# EAGLE design MBC3_multi_1-3 (EAGLE 9.6.2)
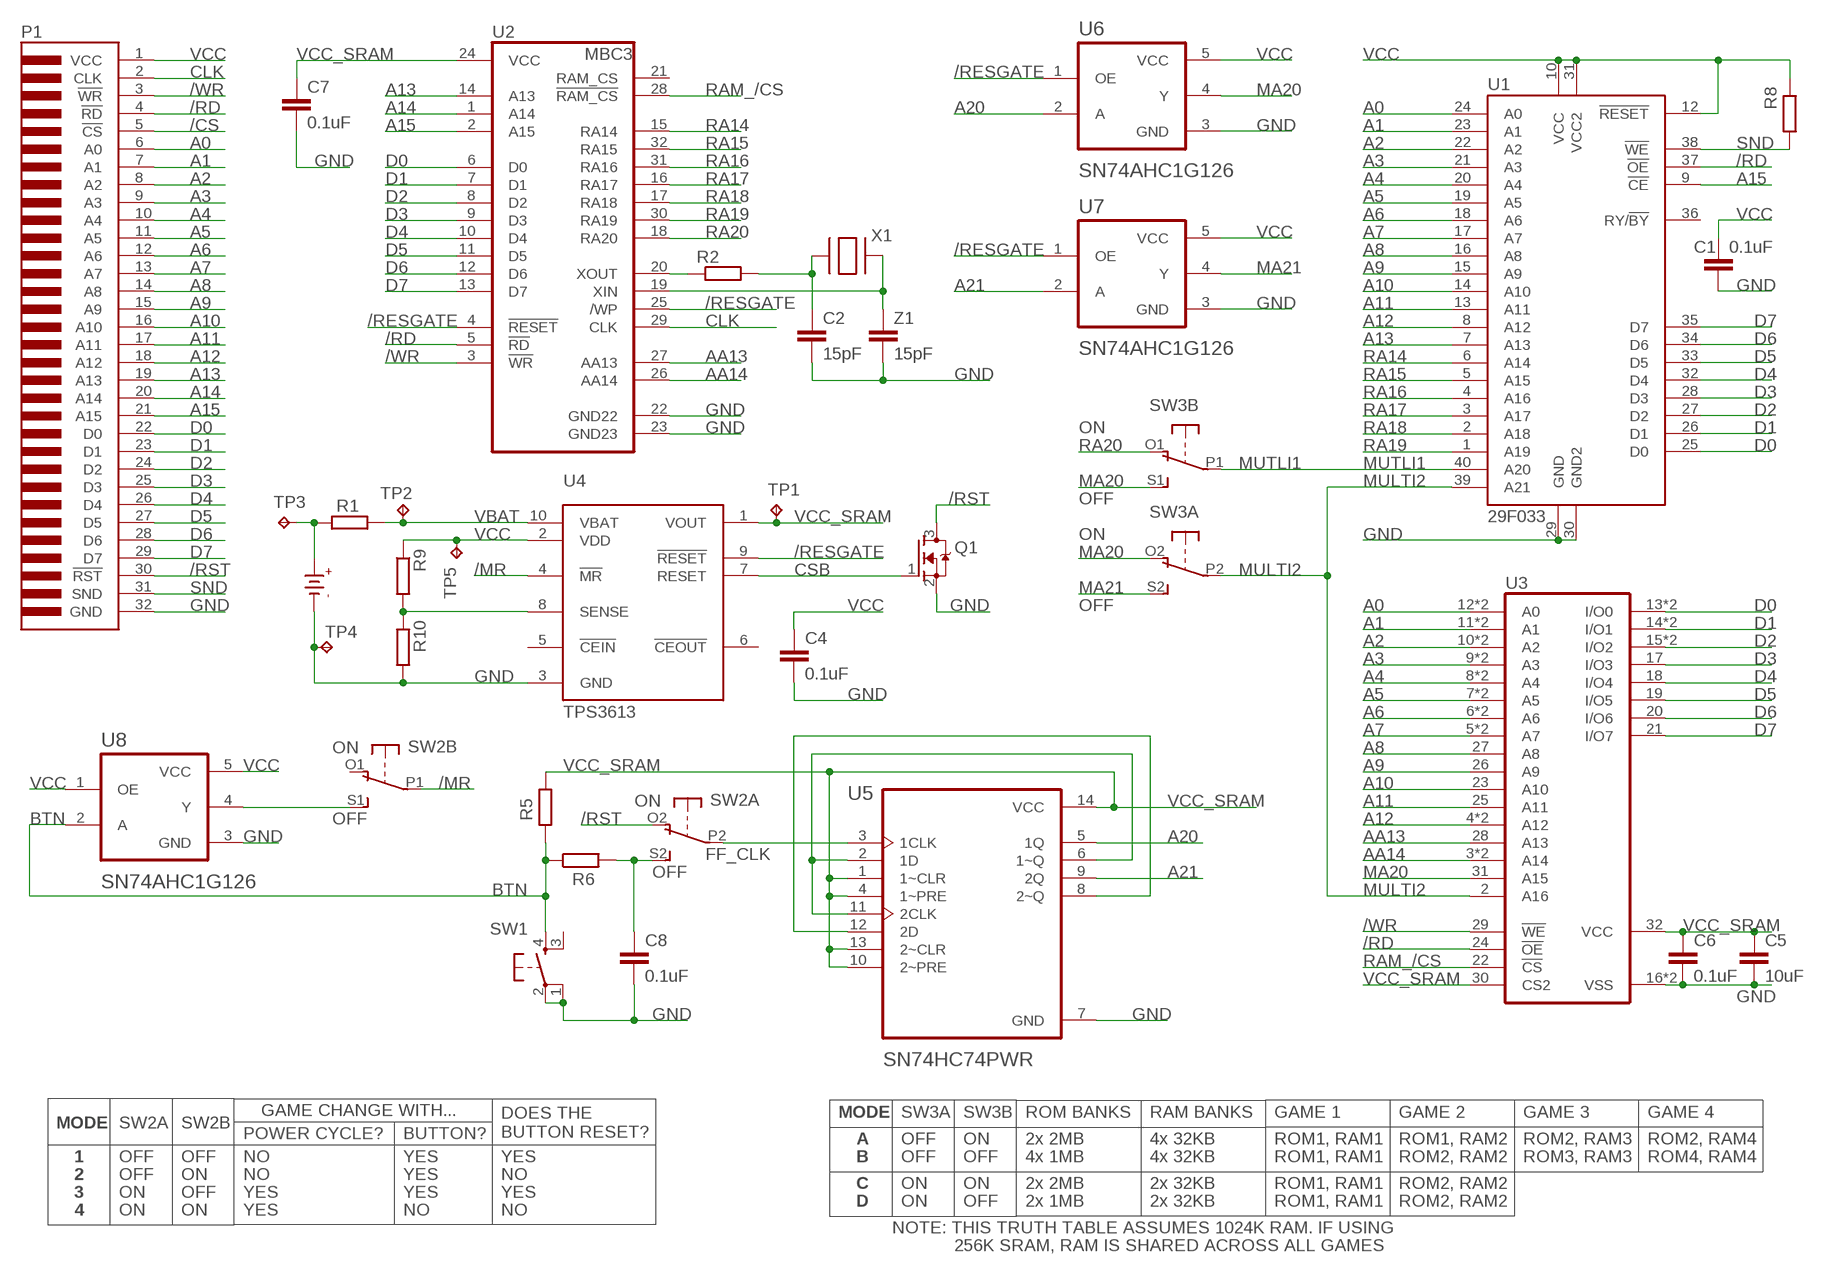
[diagram p0: schematic, sheet 1]

## Parts
C1  0.1uF  C-EUC0603  [C0603]
C2  15pF  C-EUC0603  [C0603]
C4  0.1uF  C-EUC0603  [C0603]
C5  10uF  C-EUC0603  [C0603]
C6  0.1uF  C-EUC0603  [C0603]
C7  0.1uF  C-EUC0603  [C0603]
C8  0.1uF  C-EUC0603  [C0603]
P1  GBC_CARTTAB  [GBC_CART_TABBED]
Q1  2N7002  MOSFET-NREFLOW  [SOT23]
R1  RR0603  [R0603]
R2  RR0603  [R0603]
R5  RR0603  [R0603]
R6  RR0603  [R0603]
R8  RR0603  [R0603]
R9  RR0603  [R0603]
R10  RR0603  [R0603]
SW1  SPST_TACT-KMR2  [KMR2]
SW2  SPDT-2S  [CAS-D20A]
SW3  SPDT-2S  [CAS-D20A]
TP1  TPB1,27  [B1,27]
TP2  TPB1,27  [B1,27]
TP3  TPB1,27  [B1,27]
TP4  TPB1,27  [B1,27]
TP5  TPB1,27  [B1,27]
U1  29F033  [TSOP-40]
U2  MBC3  [QFP-32]
U3  1008_62256_SRAM  [SOP-32L]
U4  TPS3613  [MSOP-10]
U5  SN74HC74PWR  [SOP65P640X120-14N]
U6  SN74AHC1G126  [SC70]
U7  SN74AHC1G126  [SC70]
U8  SN74AHC1G126  [SC70]
U$7  CR2025  [CR2025]
X1  XTAL-3.2X1.5  [XTAL3215]
Z1  15pF  C-EUC0603  [C0603]

## Nets
/CS: P1.5(!CS)
/MR: SW2.P1(A:P) U4.4(!MR)
/RD: P1.4(!RD) U1.37(!OE) U2.5(!RD) U3.24(!OE)
/RESGATE: U2.4(!RESET) U2.25(/WP) U4.9(!RESET) U6.1(OE) U7.1(OE)
/RST: P1.30(!RST) Q1.3(D) SW2.O2(B:O)
/WR: P1.3(!WR) U2.3(!WR) U3.29(!WE)
A0: P1.6(A0) U1.24(A0) U3.12(A0) U3.L12(A0)
A1: P1.7(A1) U1.23(A1) U3.11(A1) U3.L11(A1)
A2: P1.8(A2) U1.22(A2) U3.10(A2) U3.L10(A2)
A3: P1.9(A3) U1.21(A3) U3.9(A3) U3.L9(A3)
A4: P1.10(A4) U1.20(A4) U3.8(A4) U3.L8(A4)
A5: P1.11(A5) U1.19(A5) U3.7(A5) U3.L7(A5)
A6: P1.12(A6) U1.18(A6) U3.6(A6) U3.L6(A6)
A7: P1.13(A7) U1.17(A7) U3.5(A7) U3.L5(A7)
A8: P1.14(A8) U1.16(A8) U3.27(A8)
A9: P1.15(A9) U1.15(A9) U3.26(A9)
A10: P1.16(A10) U1.14(A10) U3.23(A10)
A11: P1.17(A11) U1.13(A11) U3.25(A11)
A12: P1.18(A12) U1.8(A12) U3.4(A12) U3.L4(A12)
A13: P1.19(A13) U1.7(A13) U2.14(A13)
A14: P1.20(A14) U2.1(A14)
A15: P1.21(A15) U1.9(!CE) U2.2(A15)
A20: U5.5(1Q) U6.2(A)
A21: U5.9(2Q) U7.2(A)
AA13: U2.27(AA13) U3.28(A13)
AA14: U2.26(AA14) U3.3(A14) U3.L3(A14)
BTN: R5.2 R6.1 SW1.4(S) U8.2(A)
CLK: P1.2(CLK) U2.29(CLK)
CSB: Q1.1(G) U4.7(RESET)
D0: P1.22(D0) U1.25(D0) U2.6(D0) U3.13(I/O0) U3.L13(I/O0)
D1: P1.23(D1) U1.26(D1) U2.7(D1) U3.14(I/O1) U3.L14(I/O1)
D2: P1.24(D2) U1.27(D2) U2.8(D2) U3.15(I/O2) U3.L15(I/O2)
D3: P1.25(D3) U1.28(D3) U2.9(D3) U3.17(I/O3)
D4: P1.26(D4) U1.32(D4) U2.10(D4) U3.18(I/O4)
D5: P1.27(D5) U1.33(D5) U2.11(D5) U3.19(I/O5)
D6: P1.28(D6) U1.34(D6) U2.12(D6) U3.20(I/O6)
D7: P1.29(D7) U1.35(D7) U2.13(D7) U3.21(I/O7)
FF_CLK: SW2.P2(B:P) U5.3(1CLK)
GND [GND]: C1.2 C2.2 C4.2 C5.2 C6.2 C7.2 C8.2 P1.32(GND) Q1.2(S) R10.2 SW1.1 SW1.2(P) TP4.TP U1.29(GND) U1.30(GND2) U2.22(GND22) U2.23(GND23) U3.16(VSS) U3.L16(VSS) U4.3(GND) U5.7(GND) U6.3(GND) U7.3(GND) U8.3(GND) U$7.- Z1.2
MA20: SW3.O2(B:O) SW3.S1(A:S) U3.31(A15) U6.4(Y)
MA21: SW3.S2(B:S) U7.4(Y)
MULTI2: SW3.P2(B:P) U1.39(A21) U3.2(A16)
MUTLI1: SW3.P1(A:P) U1.40(A20)
N$1: C8.1 R6.2 SW2.S2(B:S)
N$2: SW2.S1(A:S) U8.4(Y)
N$3 [VCC]: R1.2 TP3.TP U$7.+
N$4: U5.2(1D) U5.6(1~Q) U5.11(2CLK)
N$6: R2.1 U2.20(XOUT)
N$7: C2.1 R2.2 X1.P$2
N$8: U2.19(XIN) X1.P$1 Z1.1
N$10: R9.2 R10.1 U4.8(SENSE)
N$14: U5.8(2~Q) U5.12(2D)
RA14: U1.6(A14) U2.15(RA14)
RA15: U1.5(A15) U2.32(RA15)
RA16: U1.4(A16) U2.31(RA16)
RA17: U1.3(A17) U2.16(RA17)
RA18: U1.2(A18) U2.17(RA18)
RA19: U1.1(A19) U2.30(RA19)
RA20: SW3.O1(A:O) U2.18(RA20)
RAM_/CS: U2.28(!RAM_CS) U3.22(!CS)
SND: P1.31(SND) R8.2 U1.38(!WE)
VBAT [VCC]: R1.1 TP2.TP U4.10(VBAT)
VCC [VCC]: C1.1 C4.1 P1.1(VCC) R8.1 R9.1 TP5.TP U1.10(VCC) U1.12(!RESET) U1.31(VCC2) U4.2(VDD) U6.5(VCC) U7.5(VCC) U8.1(OE) U8.5(VCC)
VCC_SRAM [VCC]: C5.1 C6.1 C7.1 R5.1 TP1.TP U2.24(VCC) U3.30(CS2) U3.32(VCC) U4.1(VOUT) U5.1(1~CLR) U5.4(1~PRE) U5.10(2~PRE) U5.13(2~CLR) U5.14(VCC)
Unconnected: SW1.3(S1) SW2.O1(A:O) U1.36(RY/!BY) U2.21(RAM_CS) U4.5(!CEIN) U4.6(!CEOUT)

## Notes on the sheet
- ON
- OFF
- ON
- OFF
- ON
- ON
- OFF
- OFF
- GAME CHANGE WITH... | MODE | SW3A | SW3B | ROM BANKS | RAM BANKS | GAME 1 | GAME 2 | GAME 3 | GAME 4
- MODE | SW2A | SW2B
- DOES THE 
  BUTTON RESET?
- POWER CYCLE? | BUTTON?
- A | OFF | ON | 2x 2MB | 4x 32KB | ROM1, RAM1 | ROM1, RAM2 | ROM2, RAM3 | ROM2, RAM4
- 1 | OFF | OFF | NO | YES | YES | B | OFF | OFF | 4x 1MB | 4x 32KB | ROM1, RAM1 | ROM2, RAM2 | ROM3, RAM3 | ROM4, RAM4
- 2 | OFF | ON | NO | YES | NO
- C | ON | ON | 2x 2MB | 2x 32KB | ROM1, RAM1 | ROM2, RAM2
- 3 | ON | OFF | YES | YES | YES
- D | ON | OFF | 2x 1MB | 2x 32KB | ROM1, RAM1 | ROM2, RAM2
- 4 | ON | ON | YES | NO | NO
- NOTE: THIS TRUTH TABLE ASSUMES 1024K RAM. IF USING
- 256K SRAM, RAM IS SHARED ACROSS ALL GAMES

## Library data of the parts
C1 C2 C4-C8 Z1 = rcl:C-EU: CAPACITOR, European symbol; SPICEPREFIX: C
P1 = gameboylib:GBC_CART
Q1 = adafruit:MOSFET-N: N-Channel Mosfet 2N7002E - 60V 260mA SOT23 [Digikey: 2N7002ET1GOSTR-ND] - REEL BSH103 - 30V 850mA SOT23 [Digikey: 568-5013-1-ND]
R1 R2 R5 R6 R8-R10 = eagle-ltspice:R: RESISTOR, European symbol; SPICEMODEL: NONE; SPICEPREFIX: R
SW1 = gameboylib:SPST_TACT: SMT 6mm switch, EVQQ2 series http://www.ladyada.net/library/eagle
SW2 SW3 = gameboylib:SPDT-2S
TP1-TP5 = testpad:TP: Test pad
U1 = gameboylib:29F033
U2 = gameboylib:MBC3: MBC3; OC_FARNELL: unknown; OC_NEWARK: unknown
U3 = gameboylib:1008_62256_SRAM
U4 = gameboylib:TPS3613
U5 = gameboylib:SN74HC74PWR: Check availability <https://pricing.snapeda.com/parts/SN74HC74PWR/Texas%20Instruments/view-part?ref=eda>; AVAILABILITY: In Stock; CHECK_PRICES: https://www.snapeda.com/parts/SN74HC74PWR/Texas+Instruments/view-part/?ref=eda; DESCRIPTION: Dual D-Type Positive-Edge-Triggered Flip-Flops With Clear and Preset; MF: Texas Instruments; MP: SN74HC74PWR; PACKAGE: TSSOP-14 Texas Instruments; PRICE: None; PURCHASE-URL: https://www.snapeda.com/api/url_track_click_mouser/?unipart_id=282074&manufacturer=Texas Instruments&part_name=SN74HC74PWR&search_term=sn74hc74; SNAPEDA_LINK: https://www.snapeda.com/parts/SN74HC74PWR/Texas+Instruments/view-part/?ref=snap
U6-U8 = gameboylib:SN74AHC1G126: Check availability <https://pricing.snapeda.com/parts/SN74AHC1G08DBVR/Texas%20Instruments/view-part?ref=eda>
U$7 = gameboylib:CR2025
X1 = gameboylib:XTAL: Low cost SMT crystals, no capacitors included http://www.ladyada.net/library/eagle

## Net classes
1 VCC: width 0.203 mm
2 GND: width 0.203 mm

## Board
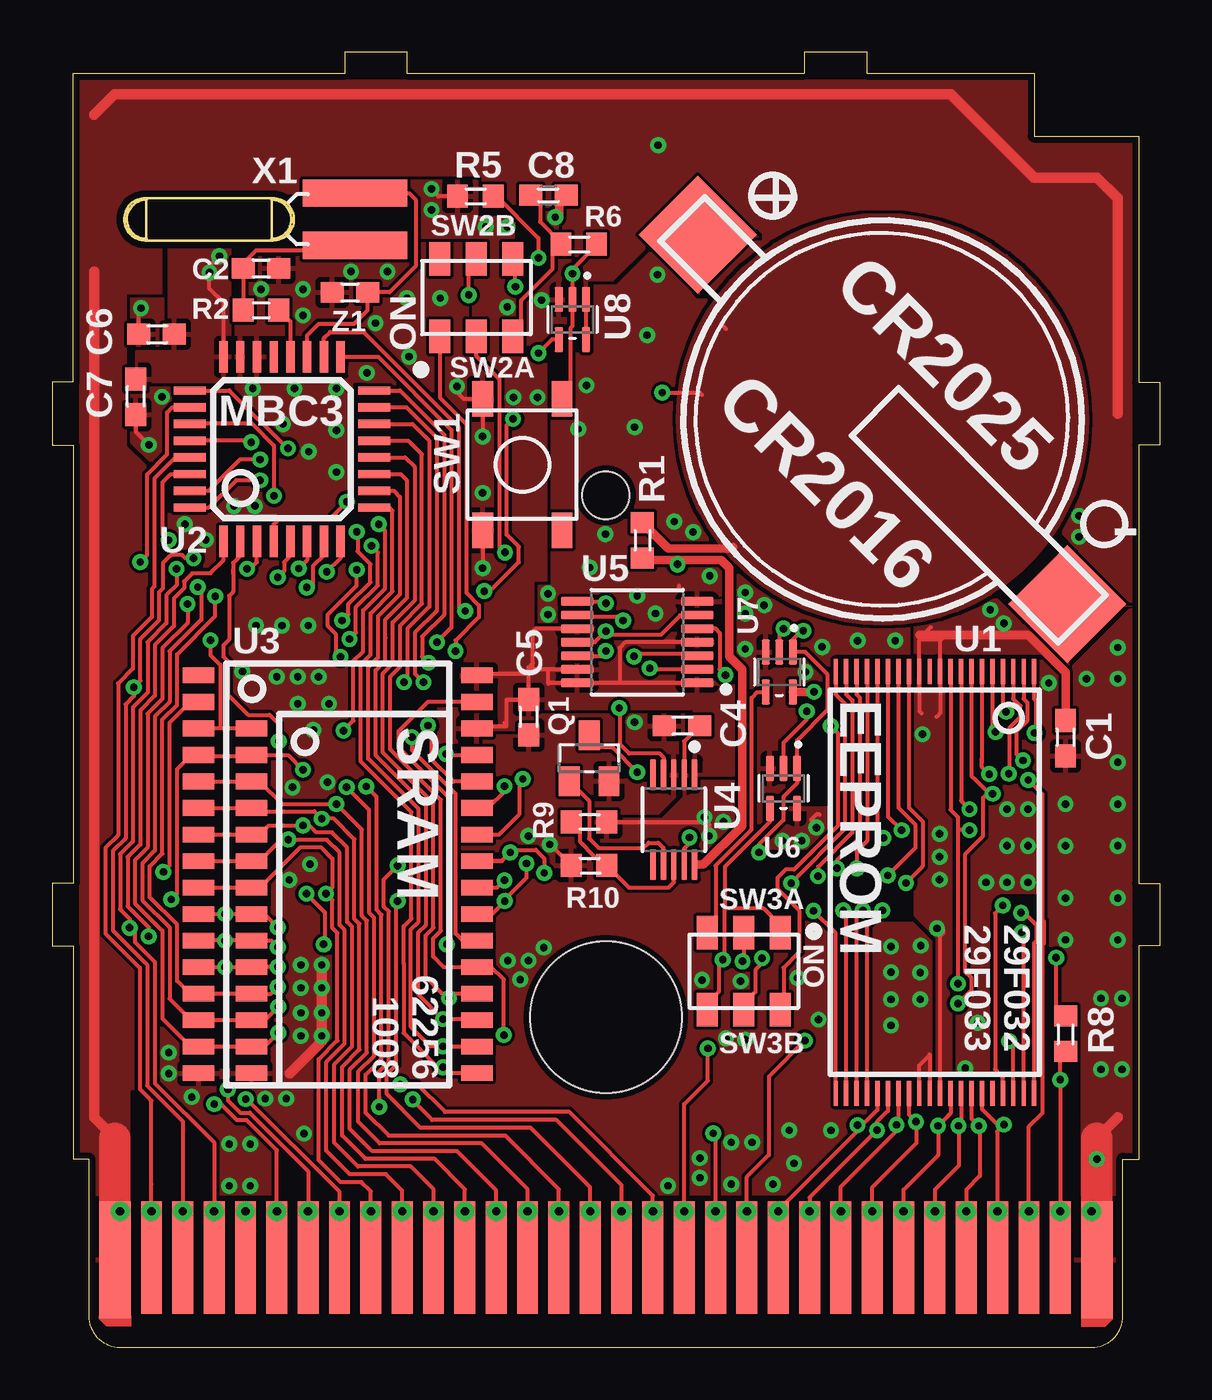
[diagram p1: board, top side]
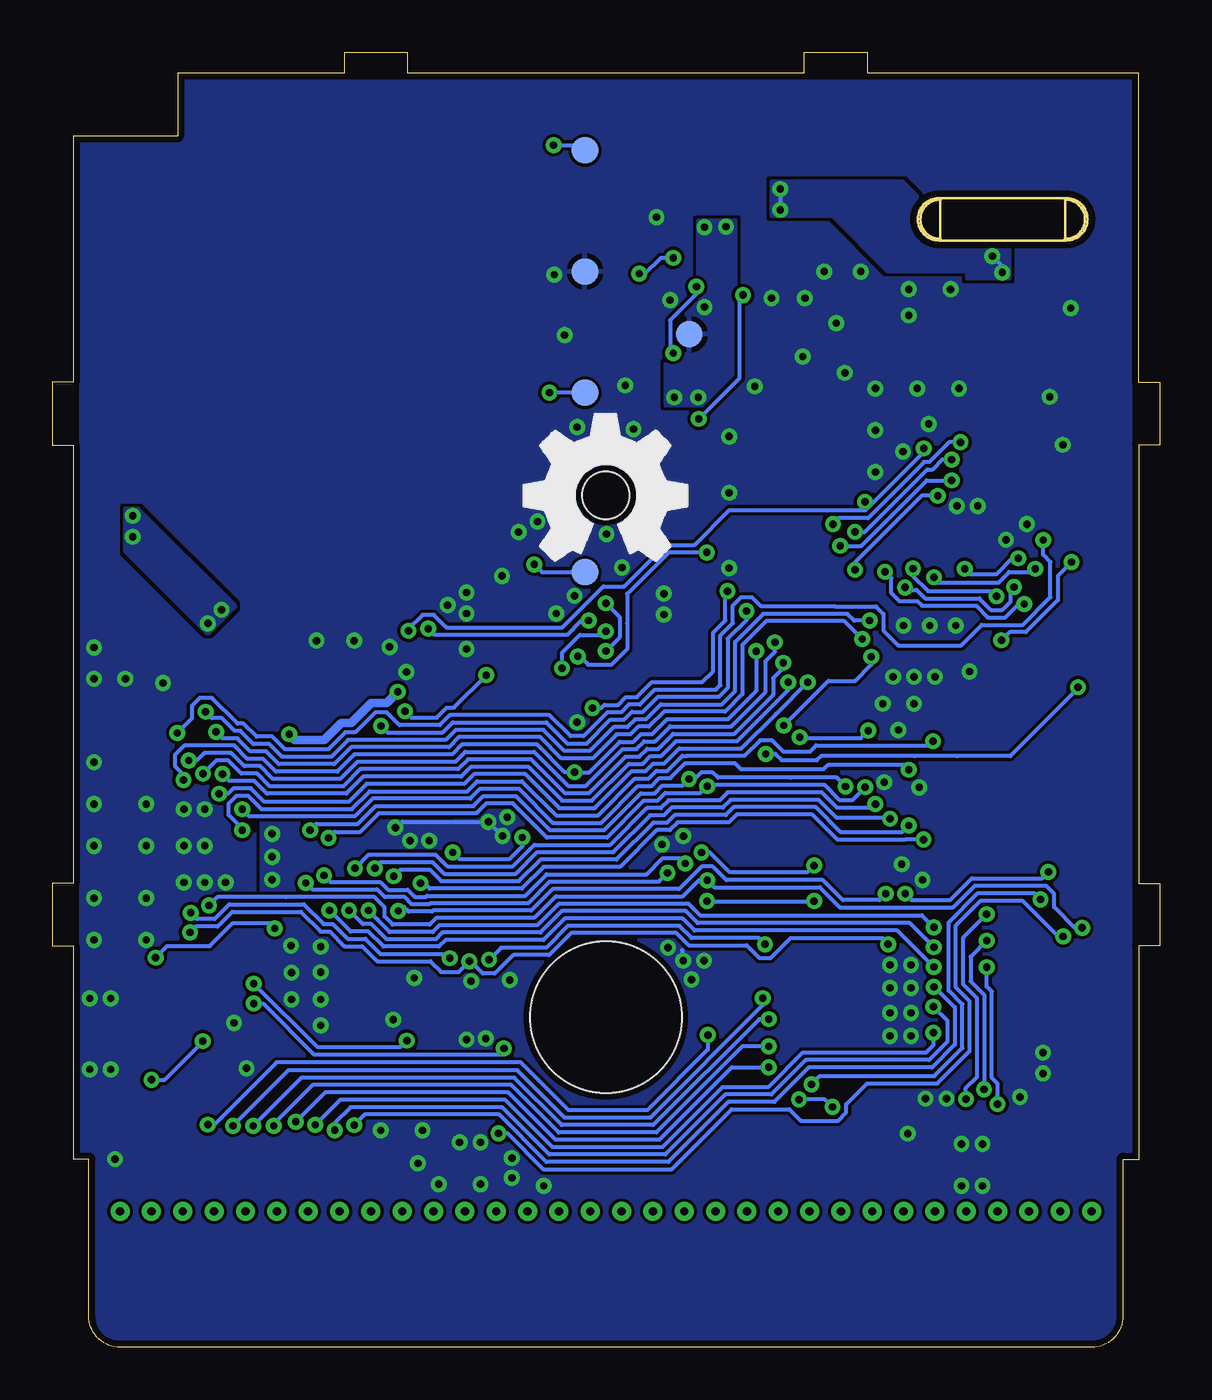
[diagram p2: board, bottom side, seen from below]

Size 53 x 62.01 mm. Coordinates in mm from the lower left corner, seen from the top.
Copper layers (1*16): Top 0.035mm / dielectric 1.5mm / Bottom 0.035mm
Design rules "default *": minimum track width 7mil, minimum drill 13mil, track to track 6mil, track to pad 7mil, pad to pad 7mil, via to via 7mil, smd to smd 5mil, copper to edge 12mil, drill to drill 22mil, minimum pad ring 10mil, minimum via ring 8mil, stop-mask expansion 4mil, vias tented up to drill 14mil, thermal gap 10mil
tKeepout: area -0.8,-1.6 to 55,11; area 0,11 to 3,62; area 50,11 to 53,62; area 3,55.1 to 50,62
tRestrict: area 48.4,5.5 to 49.1,15.6; area 47.6,0.7 to 50.9,1.2; area 8.3,38 to 14.5,39.4; area 14.5,39.5 to 15,46.1; area 10.1,46.5 to 14.1,47; area 9.3,46.5 to 9.5,48.3; area 10.1,48.1 to 11.9,48.3; area 18.9,31.3 to 19.4,32.8; area 37.5,11.5 to 45.8,12.9; area 37.5,32.1 to 47.1,33; area 39.9,20.5 to 41.1,23.3; area 45.5,21.3 to 47.3,21.6; area 5.7,6.3 to 36,7.2; area 3.9,4 to 4.6,12.2; area 20.8,13.3 to 21.1,20.7; area 20.8,27.4 to 21.1,28.2; area 20.9,30 to 21.2,31.8; area 10.1,27.2 to 10.4,28; area 10.1,21.2 to 10.4,22; area 6.2,13.4 to 10.4,13.9; area 45.3,34.7 to 49,38.9; area 10.9,60.8 to 42.9,61.3; area 0.7,15 to 1.2,47; area 51.8,14.7 to 52.3,46.7
bRestrict: area 51.8,14.7 to 52.3,46.7; area 0.7,15 to 1.2,47; area 10.9,60.8 to 42.9,61.3

### Footprints (pad centres in the part's own frame; a part is rotated, then mirrored left to right if it is on the bottom)
C0603 = smd 1.1 x 1: 1 -0.85,0; 2 0.85,0
GBC_CART_TABBED = smd 1.5 x 5.6: 1 -23.4,-25.01; 32 23.6,-25.01 | smd 1 x 5.4: 2 -21.65,-24.91; 3 -20.15,-24.91; 4 -18.65,-24.91; 5 -17.15,-24.91; 6 -15.65,-24.91; 7 -14.15,-24.91; 8 -12.65,-24.91; 9 -11.15,-24.91; 10 -9.65,-24.91; 11 -8.15,-24.91; 12 -6.65,-24.91; 13 -5.15,-24.91; 14 -3.65,-24.91; 15 -2.15,-24.91; 16 -0.65,-24.91; 17 0.85,-24.91; 18 2.35,-24.91; 19 3.85,-24.91; 20 5.35,-24.91; 21 6.85,-24.91; 22 8.35,-24.91; 23 9.85,-24.91; 24 11.35,-24.91; 25 12.85,-24.91; 26 14.35,-24.91; 27 15.85,-24.91; 28 17.35,-24.91; 29 18.85,-24.91; 30 20.35,-24.91; 31 21.85,-24.91 | drill 0.4: P$1 -21.65,-22.7; P$2 -18.65,-22.7; P$3 -15.65,-22.7; P$4 -12.65,-22.7; P$5 -9.65,-22.7; P$6 -6.65,-22.7; P$7 -3.65,-22.7; P$8 -0.65,-22.7; P$9 2.35,-22.7; P$10 5.35,-22.7; P$11 8.35,-22.7; P$12 11.35,-22.7; P$13 14.35,-22.7; P$14 17.35,-22.7; P$15 20.35,-22.7; P$16 23.35,-22.7; P$17 21.85,-22.7; P$18 18.85,-22.7; P$19 15.85,-22.7; P$20 12.85,-22.7; P$21 9.85,-22.7; P$22 6.85,-22.7; P$23 3.85,-22.7; P$24 0.85,-22.7; P$25 -2.15,-22.7; P$26 -5.15,-22.7; P$27 -8.15,-22.7; P$28 -11.15,-22.7; P$29 -14.15,-22.7; P$30 -17.15,-22.7; P$31 -20.15,-22.7; P$32 -23.15,-22.7 | hole 7.25: 0.1,-13.41 | hole 2.25: 0.1,11.585
SOT23 = smd 1 x 1.4: 1 -0.95,-1.1; 2 0.95,-1.1; 3 0,1.1
R0603 = smd 1 x 1.1: 1 -0.85,0; 2 0.85,0
KMR2 = smd 1.7 x 1: 1 -3.15,1.9; 2 3.15,1.9; 3 -3.15,-1.9; 4 3.15,-1.9
CAS-D20A = smd 1 x 1.6: O1 -1.75,1.85; O2 -1.75,-1.85; P1 0,1.85; P2 0,-1.85; S1 1.75,1.85; S2 1.75,-1.85
B1,27 = smd 1.27 x 1.27: TP 0,0
TSOP-40 = smd 1.2 x 0.21: 1 -10.1,4.75; 2 -10.1,4.25; 3 -10.1,3.75; 4 -10.1,3.25; 5 -10.1,2.75; 6 -10.1,2.25; 7 -10.1,1.75; 8 -10.1,1.25; 9 -10.1,0.75; 10 -10.1,0.25; 11 -10.1,-0.25; 12 -10.1,-0.75; 13 -10.1,-1.25; 14 -10.1,-1.75; 15 -10.1,-2.25; 16 -10.1,-2.75; 17 -10.1,-3.25; 18 -10.1,-3.75; 19 -10.1,-4.25; 20 -10.1,-4.75; 21 10.1,-4.75; 22 10.1,-4.25; 23 10.1,-3.75; 24 10.1,-3.25; 25 10.1,-2.75; 26 10.1,-2.25; 27 10.1,-1.75; 28 10.1,-1.25; 29 10.1,-0.75; 30 10.1,-0.25; 31 10.1,0.25; 32 10.1,0.75; 33 10.1,1.25; 34 10.1,1.75; 35 10.1,2.25; 36 10.1,2.75; 37 10.1,3.25; 38 10.1,3.75; 39 10.1,4.25; 40 10.1,4.75
QFP-32 = smd 0.4 x 1.524: 1 -2.8,-4.415; 2 -2,-4.415; 3 -1.2,-4.415; 4 -0.4,-4.415; 5 0.4,-4.415; 6 1.2,-4.415; 7 2,-4.415; 8 2.8,-4.415; 17 2.8,4.415; 18 2,4.415; 19 1.2,4.415; 20 0.4,4.415; 21 -0.4,4.415; 22 -1.2,4.415; 23 -2,4.415; 24 -2.8,4.415 | smd 1.524 x 0.4: 9 4.415,-2.8; 10 4.415,-2; 11 4.415,-1.2; 12 4.415,-0.4; 13 4.415,0.4; 14 4.415,1.2; 15 4.415,2; 16 4.415,2.8; 25 -4.415,2.8; 26 -4.415,2; 27 -4.415,1.2; 28 -4.415,0.4; 29 -4.415,-0.4; 30 -4.415,-1.2; 31 -4.415,-2; 32 -4.415,-2.8
SOP-32L = smd 0.75 x 1.5: 1 -10.16,-7.997; 2 -8.89,-7.997; 3 -7.62,-5.457; 4 -6.35,-5.457; 5 -5.08,-5.457; 6 -3.81,-5.457; 7 -2.54,-5.457; 8 -1.27,-5.457; 9 0,-5.457; 10 1.27,-5.457; 11 2.54,-5.457; 12 3.81,-5.457; 13 5.08,-5.457; 14 6.35,-5.457; 15 7.62,-5.457; 16 8.89,-5.457; 17 8.89,5.33; 18 7.62,5.33; 19 6.35,5.33; 20 5.08,5.33; 21 3.81,5.33; 22 2.54,5.33; 23 1.27,5.33; 24 0,5.33; 25 -1.27,5.33; 26 -2.54,5.33; 27 -3.81,5.33; 28 -5.08,5.33; 29 -6.35,5.33; 30 -7.62,5.33; 31 -8.89,5.33; 32 -10.16,5.33; L3 -7.62,-7.997; L4 -6.35,-7.997; L5 -5.08,-7.997; L6 -3.81,-7.997; L7 -2.54,-7.997; L8 -1.27,-7.997; L9 0,-7.997; L10 1.27,-7.997; L11 2.54,-7.997; L12 3.81,-7.997; L13 5.08,-7.997; L14 6.35,-7.997; L15 7.62,-7.997; L16 8.89,-7.997
MSOP-10 = smd 1.47 x 0.28: 1 -2.15,1; 2 -2.15,0.5; 3 -2.15,0; 4 -2.15,-0.5; 5 -2.15,-1; 6 2.15,-1; 7 2.15,-0.5; 8 2.15,0; 9 2.15,0.5; 10 2.15,1
SOP65P640X120-14N = smd 1.57 x 0.41: 1 -2.87,1.95; 2 -2.87,1.3; 3 -2.87,0.65; 4 -2.87,0; 5 -2.87,-0.65; 6 -2.87,-1.3; 7 -2.87,-1.95; 8 2.87,-1.95; 9 2.87,-1.3; 10 2.87,-0.65; 11 2.87,0; 12 2.87,0.65; 13 2.87,1.3; 14 2.87,1.95
SC70 = smd 1.19 x 0.4: 1 -0.96,0.65; 2 -0.96,0; 3 -0.96,-0.65; 4 0.96,-0.65; 5 0.96,0.65
CR2025 = smd 4 x 4: + -12,0; - 13,0
XTAL3215 = smd 1.3 x 5: P$1 1.25,0.5; P$2 -1.25,0.5

### Placement (x,y rotation side)
C1  48.5,29.16 270 top
C2  10,51.66 0 top
C4  30.15,29.76 180 top
C5  22.8,30.16 270 top
C6  5,48.51 180 top
C7  4,45.51 270 top
C8  23.75,55.16 0 top
P1  26.4,29.21 0 top
Q1  25.7,28.21 0 top
R1  28.25,38.64 90 top
R2  10,49.66 180 top
R5  20.25,55.11 0 top
R6  25.2,52.81 180 top
R8  48.5,15.01 270 top
R9  25.7,25.16 180 top
R10  25.7,23.06 180 top
SW1  22.5,42.26 90 top
SW2  20.3,50.26 0 top
SW3  33.1,18.01 180 top
TP1  22.5,48.51 0 bottom
TP2  27.5,37.11 0 bottom
TP3  27.5,45.71 0 bottom
TP4  27.5,51.51 0 bottom
TP5  27.5,57.31 0 bottom
U1  42.25,22.26 270 top
U2  11,43.01 0 top
U3  15,22.01 270 top
U4  29.75,25.26 270 top
U5  28,33.76 180 top
U6  35,26.76 270 top
U7  34.8,32.34 270 top
U8  24.9,49.21 270 top
U$7  39.39,44.79 315 top
X1  15,54.01 90 top
Z1  14.25,50.51 180 top

### Tracks (layer width: path | path; a pad name or v marks a point on that pad's centre or on a via)
/MR  (via drill 0.35)
  Top 0.2: U4.4 29.27,27.43 29.27,28.24 29.09,28.42 27.61,28.42 27.18,28.85 27.18,30.58 v27.14,30.61 | v20.68,36.2 20.81,36.07 22.33,37.6 22.33,38.33 21.75,38.91 21.75,44.15 v22.06,44.45 | SW2.P1 19.94,51.75 v19.94,50.39
  Bottom 0.2: v27.14,30.61 26.71,30.61 26.57,30.76 25.91,30.76 25.54,31.12 25.02,31.12 24.3,31.84 21.89,31.84 21.37,32.36 21.37,34.22 20.79,34.8 | 20.79,34.8 20.78,34.81 | 20.79,34.8 20.79,36.09 v20.68,36.2 | v22.06,44.45 20.1,46.41 20.1,50.22 v19.94,50.39
/RD  (via drill 0.35)
  Top 0.2: P1.4 7.75,9.82 4.92,12.65 4.92,18.44 3.96,19.4 3.96,19.83 v3.7,20.09 3.7,20.52 3.25,20.97 3.25,23.61 3.86,24.22 3.86,30.64 4.57,31.34 4.57,33.77 5.47,34.67 5.47,36.01 5.95,36.49 v5.95,37.27 v5.94,37.28 | U3.24 21.3,22.01 v21.65,22.36 | v45.5,21.16 45.12,20.79 45.12,13.31 45.21,13.22 45.5,12.94 U1.37 | U2.5 11.4,37.89 11.1,37.59 11.1,37.17 v10.8,36.87 v10.79,36.87
  Bottom 0.2: v45.5,21.16 45.1,21.56 41.82,21.56 41.8,21.57 37.59,21.57 37.09,21.07 37.09,20.62 36.71,20.24 34.93,20.24 34.61,20.56 29.93,20.56 28.9,21.59 22.82,21.59 22.05,22.36 v21.65,22.36 21.31,22.02 16.26,22.02 15.3,21.06 9.88,21.06 8.84,22.1 5.42,22.1 5.04,21.72 5.04,21.07 4.05,20.09 v3.7,20.09 | v5.95,37.27 6.1,37.12 7.2,37.12 7.71,36.62 10.54,36.62 v10.79,36.87
/RESGATE  (via drill 0.35)
  Top 0.2: U2.25 8.48,45.81 11.24,43.04 v11.28,43.04 | v30.5,24.41 30.5,24.14 30.25,23.89 U4.9 | 33.85,23.7 v33.83,23.7 33.83,24.07 35,25.25 35,26.36 35.65,27.01 U6.1 35.65,29.06 37.12,30.53 37.12,32.21 36.03,33.3 U7.1 35.45,33.89 35.87,34.31 v35.95,34.31 | U2.4 10.6,39.4 10.83,39.64 13.25,39.64 v14.1,40.48
  Bottom 0.2: v11.28,43.04 11.28,42.86 14.07,40.08 | v33.83,23.7 33.51,23.39 31.1,23.39 30.5,23.99 v30.5,24.41 | 14.07,40.08 20.59,40.08 22.25,38.41 23.65,38.41 25.62,36.44 26.62,36.44 28.59,34.47 34.13,34.47 34.73,35.07 35.27,35.07 35.95,34.39 v35.95,34.31 | v14.1,40.48 14.1,40.1 14.07,40.08
/RST  (via drill 0.35)
  Top 0.2: P1.30 46.75,10.57 47.39,11.21 47.39,19.25 47.45,19.31 47.45,20.41 47.39,20.47 47.39,26.49 v46.72,27.16 | SW2.O2 18.55,45.48 19.82,44.21 19.82,36.13 20.43,35.53 20.43,34.96 19.31,33.84 v19.31,33.33 | Q1.3 25.7,29.09 26.07,28.71 26.82,28.71 v28,27.53
  Bottom 0.2: v46.72,27.16 46.72,27.42 47.12,27.83 47.12,28.37 46.69,28.81 44.29,28.81 43.66,28.18 42.9,28.18 42.29,27.57 39.36,27.57 38.54,28.39 33.86,28.39 33.39,28.86 29.79,28.86 28.46,27.53 v28,27.53 27.3,27.53 25.84,28.99 25.18,28.99 24.81,29.36 24.29,29.36 23.57,30.08 20.65,30.08 19.31,31.43 v19.31,33.33
/WR  (via drill 0.35)
  Top 0.2: v18.85,28.41 18.9,28.36 U3.29 | P1.3 6.25,10.82 4.54,12.52 4.54,18.32 2.9,19.96 2.9,23.76 3.51,24.37 3.51,30.78 3.9,31.18 v3.9,31.61 4.21,31.92 4.21,33.91 5.12,34.82 5.12,36.15 5.29,36.33 5.29,37.54 5.68,37.93 6.22,37.93 6.37,37.78 v6.76,37.78 | U2.3 9.8,37.59 9.48,37.27 v9.32,37.27
  Bottom 0.2: 18.85,28.36 v18.85,28.41 18.39,28.41 18.09,28.11 16.4,28.11 16.2,28.31 11.73,28.31 11.72,28.31 9.7,28.31 7.14,28.31 3.9,31.55 v3.9,31.61 | v6.76,37.78 7.04,37.78 7.8,37.02 9.07,37.02 v9.32,37.27
A0  (via drill 0.35)
  Top 0.2: v10.8,18.21 9.8,18.21 U3.12 v8.27,18.2 U3.L12 | v39.73,20.92 39,20.18 U1.24 | v7.76,11.65 8.08,11.65 8.85,10.88 9.31,10.88 10.75,9.44 P1.6
  Bottom 0.2: 22.25,19.95 22.83,20.54 28.46,20.54 29.49,19.5 34.17,19.5 34.49,19.18 37.14,19.18 37.87,19.91 38.72,19.91 v39.73,20.92 | v7.76,11.65 7.76,12.07 7.75,12.07 7.75,12.62 8.03,12.9 8.03,17.03 8.27,17.27 v8.27,18.2
  Bottom 0.203: v10.8,18.21 12.54,19.95 22.25,19.95
A1  (via drill 0.35)
  Top 0.2: v10.8,19.16 10.5,19.46 9.55,19.46 U3.11 v8.27,19.47 U3.L11 | 38.49,20.6 38.49,20.59 | 38.49,20.59 38.49,16.13 38.5,16.13 U1.23 | v38.8,20.92 38.8,20.89 38.49,20.59 | v8.41,12.35 8.41,11.82 8.99,11.23 9.46,11.23 12.25,8.43 P1.7
  Bottom 0.2: 22.1,20.31 22.11,20.31 22.69,20.89 28.61,20.89 29.64,19.86 34.32,19.86 34.64,19.54 37,19.54 37.72,20.26 38.14,20.26 v38.79,20.92 v38.8,20.92 | v8.27,19.47 9.04,18.7 9.04,17.52 8.38,16.86 8.38,12.37 v8.41,12.35
  Bottom 0.203: v10.8,19.16 11.95,20.31 22.1,20.31
A2  (via drill 0.35)
  Top 0.2: v10.8,20.11 10.18,20.74 10.15,20.74 10.14,20.74 U3.10 v8.28,20.74 U3.L10 | v37.87,20.92 37.89,20.9 38,20.78 U1.22 | P1.8 13.75,7.43 9.3,11.89 v9.27,11.89
  Bottom 0.2: v10.8,20.11 11.38,20.69 21.99,20.69 22.54,21.24 28.75,21.24 29.79,20.21 34.47,20.21 34.79,19.89 36.85,19.89 37.44,20.48 37.44,20.5 v37.87,20.92 | v9.27,11.89 9.27,12.43 8.73,12.96 8.73,16.72 9.39,17.38 9.39,19.62 v8.28,20.74
A3  (via drill 0.35)
  Top 0.2: P1.9 15.25,7.46 14.8,7.91 13.8,7.91 12.75,8.96 12.75,13.8 13.64,14.69 13.64,19.84 13.41,20.07 13.41,21.42 v13.11,21.72 | v36.43,20.9 37.5,19.83 U1.21 | v13.11,21.72 | v13.11,21.72 13.41,22.02 13.41,23.39 12.85,23.95 11.89,23.95 9.95,22.01 U3.9 U3.L9
  Bottom 0.2: v36.43,20.9 36.24,21.09 36.17,21.09 35.94,20.86 34.81,20.86 34.76,20.91 30.08,20.91 29.05,21.94 22.99,21.94 21.92,23.02 21.38,23.02 20.74,22.37 16.11,22.37 15.15,21.42 13.41,21.42 v13.11,21.72
A4  (via drill 0.35)
  Top 0.2: P1.10 16.75,7.5 15.96,8.29 14.25,8.29 13.12,9.41 13.12,13.67 14,14.55 14,19.98 13.76,20.22 13.76,23.69 13.15,24.3 v11.31,24.3 v11.3,24.31 10.97,24.31 9.94,23.28 U3.8 U3.L8 | v35.38,22.22 35.38,22.25 37.94,24.81 37.94,30.83 37.5,31.27 U1.20
  Bottom 0.2: v35.38,22.22 35.28,22.32 34.93,21.97 30.52,21.97 29.48,23 25.82,23 24.06,24.76 23.43,24.76 23.06,25.13 20.61,25.13 20.23,25.51 16.61,25.51 15.4,24.3 12.19,24.3 12.18,24.31 v11.3,24.31
A5  (via drill 0.35)
  Top 0.2: P1.11 18.25,7.56 17.15,8.66 14.62,8.66 13.5,9.79 13.5,13.55 14.35,14.4 14.35,20.13 14.11,20.36 14.11,23.92 13.38,24.65 12.63,24.65 12.3,24.99 v12,24.99 10.38,24.99 9.94,24.55 U3.7 U3.L7 | v36.66,22.56 36.66,23.01 38.3,24.65 38.3,30.97 38,31.27 U1.19
  Bottom 0.2: 36.66,22.51 v36.66,22.56 36.64,22.56 36.32,22.88 34.94,22.88 34.39,22.32 30.66,22.32 29.63,23.35 26,23.35 24.24,25.11 23.58,25.11 23.21,25.49 20.75,25.49 20.38,25.86 16.46,25.86 15.26,24.65 12.33,24.65 v12,24.99
A6  (via drill 0.35)
  Top 0.2: P1.12 19.75,7.56 18.3,9.01 15,9.01 13.88,10.14 13.88,13.43 14.7,14.25 14.7,20.27 14.47,20.51 14.47,24.32 13.48,25.31 v12.9,25.31 12.55,25.66 10.08,25.66 9.92,25.82 U3.6 U3.L6 | v37.56,22.94 37.56,23.31 38.65,24.4 38.65,31.12 38.5,31.27 U1.18
  Bottom 0.2: v12.9,25.31 12.94,25.35 15.46,25.35 16.32,26.21 20.52,26.21 20.9,25.84 23.35,25.84 23.73,25.47 24.39,25.47 26.15,23.71 29.77,23.71 30.81,22.67 34.24,22.67 34.8,23.24 37.28,23.24 37.56,22.96 v37.56,22.94
A7  (via drill 0.35)
  Top 0.2: P1.13 21.25,7.51 19.38,9.39 15.32,9.39 14.25,10.46 14.25,13.3 15.05,14.11 15.05,20.42 14.82,20.66 14.82,24.79 v13.6,26.01 11,26.01 9.92,27.09 U3.5 U3.L5 | v38.51,22.94 38.51,23.76 39,24.25 U1.17
  Bottom 0.2: v13.6,26.01 13.77,25.84 15.45,25.84 16.17,26.57 20.67,26.57 21.05,26.19 23.5,26.19 23.87,25.82 24.53,25.82 26.29,24.06 29.92,24.06 30.95,23.03 34.09,23.03 34.66,23.59 37.85,23.59 v38.51,22.94
A8  (via drill 0.35)
  Top 0.2: P1.14 22.75,7.56 20.55,9.76 15.68,9.76 14.62,10.81 14.62,13.18 15.41,13.96 15.41,20.57 15.17,20.8 15.17,25.74 v14.09,26.81 | U3.27 20.85,25.82 21.65,26.62 v21.65,26.87 | U1.16 39.5,24.67 v39.78,24.39
  Bottom 0.2: v14.09,26.81 14.71,26.19 15.3,26.19 16.03,26.92 21.6,26.92 v21.65,26.87 21.97,26.54 23.65,26.54 24.02,26.17 24.68,26.17 26.44,24.41 29.32,24.41 30.95,26.04 32.22,26.04 32.69,25.57 37.37,25.57 38.25,24.69 39.48,24.69 v39.78,24.39
A9  (via drill 0.35)
  Top 0.2: P1.15 24.25,7.56 21.67,10.14 16.1,10.14 | U3.26 21.39,24.55 22.35,25.51 22.35,27.04 v22.52,27.21 | 15,11.24 15,13.06 15.76,13.82 15.76,20.71 15.52,20.95 15.52,26.35 v15.03,26.85 | v40.66,24.76 40,25.42 U1.15
  Top 0.203: v15.03,26.85 15,26.85 | 15,11.24 16.1,10.14
  Bottom 0.2: v40.66,24.76 40.36,25.06 38.38,25.06 37.52,25.92 32.84,25.92 32.36,26.39 30.81,26.39 29.18,24.76 26.58,24.76 24.82,26.52 24.16,26.52 23.79,26.9 22.84,26.9 v22.52,27.21 | 15.45,27.27 17.64,27.27 21.13,27.27 21.38,27.52 21.94,27.52 22.19,27.27
  Bottom 0.203: v15.03,26.85 15.45,27.27 | v22.52,27.21 22.46,27.27 22.19,27.27
A10  (via drill 0.35)
  Top 0.2: P1.16 25.75,7.66 22.9,10.51 17.62,10.51 16,12.14 16,13.06 16.46,13.52 16.46,21.3 v16.53,21.37 | U3.23 20.09,20.75 21.07,20.75 21.66,21.35 | v22.7,23.17 22.7,22.48 21.66,21.45 v21.66,21.37 | v39.99,22.6 41.31,23.92 41.31,25.03 40.5,25.84 U1.14
  Top 0.203: v21.66,21.37 21.66,21.35
  Bottom 0.2: v22.7,23.17 22.96,23.42 23.78,23.42 24.55,22.65 29.34,22.65 30.37,21.62 35.05,21.62 35.1,21.57 35.65,21.57 35.99,21.91 36.93,21.91 37.3,22.28 39.67,22.28 v39.99,22.6 | 16.53,21.35 v16.53,21.37
  Bottom 0.203: 16.53,21.35 21.66,21.35 v21.66,21.37
A11  (via drill 0.35)
  Top 0.2: P1.17 27.25,7.76 24.12,10.89 18.19,10.89 17.26,11.82 v17.26,11.87 | U3.25 21.52,23.28 22.06,23.82 23.14,23.82 23.55,23.42 v23.55,22.72 | v40.87,22.23 41.66,23.03 41.66,25.18 41,25.84 U1.13 | v15.66,11.51 15.66,11.96 15.65,11.96 15.65,13.21 16.11,13.67 16.11,20.86 15.88,21.09 15.88,22.41 v16.53,23.07
  Top 0.203: v21.93,23.69 21.51,23.28 U3.25
  Bottom 0.2: v15.66,11.51 16.01,11.87 v17.26,11.87 | v23.55,22.72 23.97,22.3 29.19,22.3 30.22,21.26 34.91,21.26 34.96,21.21 35.79,21.21 36.13,21.55 37.07,21.55 37.45,21.93 40.56,21.93 v40.87,22.23 | v16.53,23.07 16.83,22.77 20.61,22.77 21.53,23.69 v21.93,23.69
A12  (via drill 0.35)
  Top 0.2: P1.18 28.75,7.26 24.75,11.26 18.8,11.26 17.48,12.59 v16.66,12.59 | U3.4 | U3.4 11.29,28.36 v12,27.65 | v43.91,25.76 43.5,26.17 U1.8 | U3.4 9.5,28.31 7.45,28.31 7.4,28.36 U3.L4 6.65,28.36 5.97,27.69 5.97,21.72 v5.7,21.45
  Bottom 0.2: v16.66,12.59 16.26,12.99 10.78,12.99 9.44,14.33 9.44,16.43 10.1,17.09 10.1,20.34 8.69,21.75 6,21.75 v5.7,21.45 | 12.23,27.88 v12,27.65 | 43.56,25.42 38.52,25.42 37.66,26.27 32.99,26.27 32.51,26.75 30.66,26.75 29.03,25.12 26.73,25.12 24.97,26.88 24.31,26.88 23.94,27.25 23.41,27.25 22.7,27.97 20.33,27.97
  Bottom 0.203: 12.23,27.88 15.88,27.88 16.08,27.68 20.04,27.68 20.33,27.97 | 43.56,25.42 v43.91,25.76
A13  (via drill 0.35)
  Top 0.2: P1.19 30.25,11.63 31.38,12.77 v31.38,14.32 | 43.48,16.46 v43.35,16.46 44.01,17.12 44.01,17.68 43.7,17.99 43.7,23.63 44.56,24.49 44.56,26.31 44.76,26.51 | 44.76,26.51 44.76,26.61 44.18,27.19 44,27.37 U1.7 | 17,34.41 17,32.01 v16.84,31.85 | v45.01,26.51 44.76,26.51 | 44.76,26.51
  Top 0.203: U2.14 17.25,44.21 18.05,43.41 18.05,35.46 17,34.41
  Bottom 0.2: v31.38,14.32 31.38,14.17 31.54,14.01 40.45,14.01 42.9,16.46 v43.35,16.46 | v16.84,31.85 18.35,30.33 18.36,30.33 20.01,28.67 22.99,28.67 23.71,27.95 24.23,27.95 24.6,27.58 25.26,27.58 27.02,25.82 28.74,25.82 30.37,27.45 32.8,27.45 33.28,26.98 37.96,26.98 38.81,26.12 42.84,26.12 43.49,26.77 44.32,26.77 44.58,26.51 v45.01,26.51
A14  (via drill 0.35)
  Top 0.2: U2.1 8.2,37.7 7.57,37.07 6.75,37.07 6.74,37.06 | 6.75,37.06 6.74,37.06 | 6.74,37.06 6.69,37.06 6.31,36.67 6.31,36.35 5.82,35.86 5.82,34.52 4.92,33.62 4.92,31.2 4.21,30.49 4.21,24.07 3.61,23.47 3.61,21.11 4.61,20.11 v4.61,19.68
  Top 0.203: P1.20 31.75,10.13 v31.64,10.24
  Bottom 0.2: 15,11.64 14,12.64 10.63,12.64 9.09,14.18 9.09,16.57 9.75,17.23 9.75,20.2 8.55,21.4 6.58,21.4 6.22,21.04 5.97,20.79 4.86,19.68 v4.61,19.68
  Bottom 0.203: v31.64,10.24 31.61,10.26 31.23,10.26 29.49,8.52 23.36,8.52 20.49,11.4 17.71,11.4 17.17,10.85 15.38,10.85 15,11.24 15,11.64
A15  (via drill 0.35)
  Top 0.2: P1.21 33.25,8.16 34.3,9.21 34.3,12.96 v36.02,14.69 | U2.2 9,37.9 8.66,37.55 8.66,37.24 8.66,36.17 8.47,35.98 8.47,33.89 8.19,33.61 8.19,33.07 8.4,32.86 8.4,31.26 9.38,30.28 10.41,30.28 10.84,29.85 v10.84,29.02 | 43.35,24.76 43.35,25.39 43,25.74 U1.9 | 43.35,24.76 v43.35,17.41 | v43.91,24.76 43.35,24.76
  Top 0.203: 8.66,37.07 8.66,37.24
  Bottom 0.2: v43.35,17.41 40.33,14.39 36.33,14.39 v36.02,14.69 | v43.91,24.76 43.91,24.83 44.56,25.49 44.56,26.03 44.18,26.42 43.63,26.42 42.99,25.77 38.66,25.77 37.81,26.62 33.13,26.62 32.66,27.1 30.52,27.1 28.89,25.47 26.88,25.47 25.11,27.23 24.45,27.23 24.08,27.6 23.56,27.6 22.84,28.32 22.6,28.32 | 22.6,28.32 19.87,28.32 19.12,29.07 18.55,29.07 18,28.51 16.74,28.51 16.44,28.82 10.75,28.82 10.84,28.91 v10.84,29.02 | 22.6,28.32 22.62,28.32
A20  (via drill 0.35)
  Top 0.203: v32.23,32.18 31.95,32.46 31.95,34.21 31.75,34.41 U5.5 | v36.11,30.45 36.11,30.05 35,28.94 U6.2
  Bottom 0.2: v36.11,30.45 35.81,30.15 34.59,30.15 34.12,30.62 33.77,30.62 v32.23,32.17 v32.23,32.18
A21  (via drill 0.35)
  Top 0.2: v35,34.41 34.8,34.21 U7.2
  Top 0.203: U5.9 25.23,34.96 27.16,34.96 v27.32,34.79
  Bottom 0.203: v27.32,34.79 27.68,34.79 28.35,34.12 34.71,34.12 v35,34.41
AA13  (via drill 0.35)
  Top 0.2: U2.27 9.57,44.22 10.61,43.18 v10.61,40.78 v10.61,40.77 | U3.28 19.22,27.09 18.17,28.13 18.17,29.58 v17.98,29.77 | v13.79,33.06 13.57,33.28 13.57,34.16 13.19,34.53 13.19,35.09 14.57,36.47 v14.57,37.23
  Bottom 0.2: v14.57,37.23 v14.58,37.23 14.58,37.58 11.38,40.77 v10.61,40.77 | v17.98,29.77 | v17.98,29.77 15.85,31.91 14.58,31.91 13.79,32.69 v13.79,33.06
AA14  (via drill 0.35)
  Top 0.2: U2.26 5.75,45.01 5.5,44.76 5.5,42.76 4.54,41.8 4.54,37.92 v4.21,37.59 | U3.3 8.1,29.63 | 8.1,29.63 7.52,29.63 7.49,29.66 | 8.1,29.63 8.05,29.68 8.05,32.67 7.57,33.15 v7.57,33.85
  Top 0.203: U3.L3 7.52,29.63
  Bottom 0.2: v7.57,33.85 7.18,34.24 6.4,34.24 4.87,35.77 4.87,36.94 v4.21,37.59
BTN  (via drill 0.35)
  Top 0.2: SW1.4 24.24,45.57 24.24,45.71 | R6.1 26.05,52.76 24.9,51.61 v24.9,51.4 U8.2 | 23.27,53.11 v23.27,52.16
  Top 0.203: 23.27,53.11 21.28,55.11 R5.2 | U8.2 24.9,48.89 24.8,48.8 24.8,46.14 24.4,45.73 | 24.4,45.91 24.4,45.73 | 24.4,45.73 24.4,45.71 24.24,45.71
  Bottom 0.2: v23.27,52.16 23.87,52.16 24.63,51.4 v24.9,51.4
CLK
  Top 0.2: P1.2 4.75,7.82 | U2.29 5.9,42.61 4.89,41.6 4.89,36.43 4.76,36.3 4.76,34.96 3.86,34.06 3.86,32.49 3.16,31.79 3.16,24.51 2.55,23.9 2.55,19.82 4.19,18.18 4.19,12.37 4.61,11.95
  Top 0.203: 4.75,7.82 4.75,11.81 4.61,11.95
CSB
  Top 0.203: Q1.1 25.7,26.16 25.7,24.36 26.15,23.91 28.3,23.91 28.55,24.16 29,24.16 29.25,23.91 U4.7
D0  (via drill 0.35)
  Top 0.2: v10.8,17.26 10.47,16.93 U3.13 U3.L13 6.58,16.93 5.97,17.54 5.97,19.34 | 39.5,11.36 38.78,10.64 v38.54,10.64 38.54,10.34 34.75,6.55 P1.22 | U2.6 12.2,37.69 v11.8,37.28 | 5.97,19.34 | v7.8,35.96 7.8,35.01 5.97,33.18 5.97,30.76 5.27,30.05 5.27,23.64 4.66,23.03 4.66,21.55 5.97,20.24 5.97,19.34
  Top 0.203: U3.13 8.95,16.93 | U1.25 39.5,11.36
  Bottom 0.2: v10.8,17.26 10.77,17.26 9.79,16.28 9.79,14.49 10.88,13.4 16.78,13.4 18.44,11.75 20.63,11.75 23.5,8.88 29.35,8.88 31.61,11.15 38.04,11.15 v38.54,10.64 | v11.8,37.28 11.8,36.94 11.07,36.21 8.05,36.21 v7.8,35.96
D1  (via drill 0.35)
  Top 0.2: v10.82,16.31 10.18,15.66 U3.14 U3.L14 6.65,15.66 5.62,16.69 5.62,20.09 4.31,21.41 4.31,23.18 4.92,23.78 4.92,30.2 5.62,30.91 5.62,33.33 7.14,34.84 7.14,36.22 v6.96,36.4 | 40,11.31 39.48,10.79 v39.48,10.39 36.25,7.17 P1.23 | v12.18,36.39 12.41,36.39 12.47,36.45 12.47,37.39 13,37.92 U2.7
  Top 0.203: U3.14 9.09,15.66 | U1.26 40,11.31
  Bottom 0.2: v10.82,16.31 10.17,15.66 10.17,14.61 11.03,13.75 16.93,13.75 18.58,12.1 20.78,12.1 23.65,9.23 29.2,9.23 31.47,11.5 38.72,11.5 39.48,10.74 v39.48,10.39 | v12.18,36.39 12.06,36.26 11.62,36.26 11.22,35.86 8.62,35.86 8.07,35.3 7.53,35.3 7.14,35.69 7.14,36.22 v6.96,36.4
D2  (via drill 0.35)
  Top 0.2: P1.24 37.75,7.69 40.43,10.37 40.43,10.63 v40.41,10.65 40.5,10.74 | v10.82,15.06 10.15,14.39 U3.15 U3.L15 6.62,14.39 5.27,15.74 5.27,19.95 3.96,21.26 3.96,23.32 4.57,23.93 4.57,30.35 5.27,31.05 5.27,33.47 6.48,34.68 v6.48,35.59 | U2.8 13.8,37.79 v13.14,37.14
  Top 0.203: U3.15 8.92,14.39 | U1.27 40.5,10.74
  Bottom 0.2: v10.82,15.06 10.82,14.46 11.18,14.11 17.07,14.11 18.73,12.45 20.93,12.45 23.8,9.58 29.05,9.58 31.32,11.85 39.21,11.85 v40.41,10.65 | v13.14,37.14 12.84,36.83 12.84,36.11 12.46,35.73 11.59,35.73 11.37,35.5 8.77,35.5 8.22,34.95 7.38,34.95 6.74,35.59 v6.48,35.59
D3  (via drill 0.35)
  Top 0.2: U3.17 18.99,13.12 v18.7,13.41 | 41,11.14 v41.34,10.8 41.37,10.78 41.37,9.78 39.25,7.66 P1.25 | U2.9 16.14,40.21 16.29,40.06 16.29,36.19 15.24,35.14 15.24,33.68 15.24,33.17 14.77,32.7 14.77,28.05 17.19,25.63 17.19,20.52 16.82,20.15 16.82,18.4 16.82,15.04 18.45,13.41
  Top 0.203: 18.45,13.41 v18.7,13.41 | U1.28 41,11.14
  Bottom 0.2: v18.7,13.41 20.47,13.41 23.94,9.94 28.91,9.94 31.18,12.2 39.94,12.2 v41.34,10.8
D4  (via drill 0.35)
  Top 0.2: U3.18 18.72,14.39 v18.7,14.41 | P1.26 40.75,7.55 42.4,9.2 v42.4,10.6 42.9,11.11 43,11.21 U1.32 | U2.10 16.35,41.01 16.64,40.72 16.64,36.05 15.59,35 15.59,33.83 15.59,33.82 15.59,33.02 15.12,32.56 15.12,28.19 17.54,25.78 17.54,20.38 17.17,20.01 17.17,15.34
  Top 0.203: v18.7,14.41 18.1,14.41 17.17,15.34
  Bottom 0.2: v18.7,14.41 19.97,14.41 24.09,10.29 28.76,10.29 31.03,12.56 40.54,12.56 42.4,10.7 v42.4,10.6
D5  (via drill 0.35)
  Top 0.2: U3.19 20.03,15.71 v18.7,15.71 17.52,16.89 17.52,19.86 17.89,20.23 17.89,25.92 15.48,28.34 15.48,32.41 15.94,32.88 15.94,33.97 15.94,34.85 16.99,35.9 16.99,41.51 16.69,41.81 U2.11 | P1.27 42.25,7.55 43.4,8.7 43.4,10.58 v43.38,10.6 43.5,10.73 U1.33
  Bottom 0.2: v18.7,15.71 19.16,15.71 24.23,10.64 28.62,10.64 30.88,12.91 41.08,12.91 v43.38,10.6
D6  (via drill 0.35)
  Top 0.2: v18.99,16.72 19.19,16.92 U3.20 18.68,16.93 17.88,17.73 17.88,19.71 18.25,20.08 18.25,26.07 15.83,28.48 15.83,32.27 16.3,32.73 16.3,34.12 16.29,34.12 16.29,34.7 17.34,35.75 17.34,42.16 16.89,42.61 U2.12 | P1.28 43.75,7.55 44.4,8.2 44.4,10.55 v44.35,10.6 44,10.95 U1.34
  Bottom 0.2: v18.99,16.72 18.99,16.38 24.38,10.99 28.47,10.99 30.74,13.26 41.69,13.26 v44.35,10.6
D7  (via drill 0.35)
  Top 0.2: P1.29 45.25,4.9 45.23,4.92 45.23,10.34 v45.55,10.66 45.25,10.66 44.5,11.41 U1.35 | v21.62,14.95 21.62,17.6 21.02,18.2 U3.21 18.74,18.2 18.23,18.71 18.23,19.57 18.6,19.94 18.6,26.21 16.18,28.63 16.18,32.12 16.65,32.59 16.65,34.26 16.65,34.56 17.7,35.61 17.7,42.76 17.05,43.41 U2.13
  Bottom 0.2: v21.62,14.95 21.62,14.25 24.52,11.35 28.28,11.35 30.58,13.65 42.27,13.65 45.25,10.66 v45.55,10.66
FF_CLK  (via drill 0.35)
  Top 0.203: U5.3 30.3,33.11 30.21,33.2 27.97,33.2 v27.85,33.08 | v21.68,38.06 21.4,38.34 21.4,46.36 20.3,47.46 SW2.P2
  Bottom 0.2: 22.1,38.06 23.5,38.06 25.49,36.07 25.49,34.67
  Bottom 0.203: v27.85,33.08 27.74,33.08 27.35,32.69 26.23,32.69 25.49,33.43 25.49,34.67 | v21.68,38.06 22.1,38.06
GND  (via drill 0.35)
  Top 0.203: C6.2 4.15,49.66 v4.25,49.76 | 30,36.28 30,36.46 | R10.2 23.83,24.08 v23.82,24.08 | v4.62,43.21 4,43.84 C7.2 | U1.30 42,14.01 41.5,13.51 U1.29 | v19.38,46.01 19.38,45.73 19.7,45.41 SW1.2 v20.6,43.61 | SW1.1 v20.6,37.31
  Top 0.4: U$7.- 48.1,34.76 | C8.2 24.27,54.84 24.27,54.31 v24.07,54.11
  Top 0.5: 50,10.01 51,11.01 | v12.9,18.31 12.9,14.66 11.36,13.12
  Top 1.5: P1.32 50,10.01
  Bottom 0.203: 22.86,19.01 22.86,18.82
  other vias: 12.9,17.21 12.9,16.01 12.9,14.91 10.2,11.91 11.2,11.91 32.5,9.81 33.5,9.81 51.2,16.71 51.2,13.31 50,9.01 50.2,13.31 50.2,16.71 40.15,17.96 40.15,16.66 41.55,16.66 9.6,45.91 11.6,45.91 13.6,45.91 13.6,43.91 13.6,41.91 51,28.01 48.5,21.51 31,8.11 31,9.06 51,32.01 51,33.51 51,26.01 48.5,26.01 51,21.51 51,19.51 48.5,19.51 10,50.66 12,50.66 12,49.41 14.3,51.51 16.05,51.51 5.25,45.51 40.15,15.41 45.7,22.26 45.7,25.76 45.7,24.01 12.5,29.56 13.18,27.06 11.5,26.81 11.75,30.81 13.25,30.81 22.79,24.48 23.73,35.09 23.73,36.09 33.17,33.44 9.7,40.28 6.35,39.41 7.35,38.66 11.34,22.38 12.34,23.13 9.75,34.56 11,34.56 12.25,34.56 12.28,42.89 11.05,44.21 25.73,37.34 28.88,35.14 25.57,46.06 35.67,17.69 36.67,15.69 33.17,14.74 32.25,14.79 31.1,17.59 21.8,18.51 22.8,18.51 23.52,19.14 22.4,17.61 40.15,19.19 41.55,17.94 41.58,19.24 44.7,22.26 46.7,22.26 46.7,24.01 46.7,25.76 43.7,13.36 44.3,15.54 32.5,7.81 34.5,7.81 35.5,8.81 37.27,10.39 35.27,10.39 29.48,7.74 8.47,7.74 9.47,7.74 8.47,9.74 9.47,9.74 6.67,11.99 5.58,13.11 5.58,14.11 12.05,10.24 11.9,18.31 11.9,17.21 11.9,16.01 11.9,14.91 11.75,32.11 12.75,32.11 10.75,32.11 8.7,40.28 48.5,24.01 51,24.01 27.88,29.93 28,35.98 15.06,46.66 9.1,32.36 32.95,17.54 23.43,50.14 33.17,35.14 36.05,32.34 36.85,33.53 40.35,33.84 38.55,33.84 33.17,36.14 34.08,35.53 27.88,44.06 25.18,43.96 28.48,48.46 28.98,51.36 18.57,50.23 16.98,50.23 15.47,49.03 17.07,47.44 31.48,36.94 26.48,38.94 20.6,40.91 47.7,31.81 49.5,32.01 30.68,39.03 29.77,39.53
  pour Bottom (rank 2): 22.25,43.11 22.25,37.01 17,37.01 16.5,37.51 16.5,40.01 15,41.51 15,49.51 17,51.51 17,52.11 21.1,52.11 21.1,48.96 17.3,48.96 17.3,43.11
  pour Bottom (rank 4): -1,63.01 55,63.01 55,-2.99 -4,-2.99 -4,60.01
  pour Top (rank 6): -1.5,64.01 54.5,64.01 54.5,-3.49 -2.5,-3.49 -2.5,63.01
MA20  (via drill 0.35)
  Top 0.2: 31.9,18.36 31.9,18.41 32.2,18.71 | SW3.S1 31.35,16.46 31.9,17.01 31.9,18.36 | SW3.O2 34.85,20.21 34.05,21.01 32.2,21.01 32.2,23.01 34.35,25.16 U6.4 | U3.31 17.98,30.9 16.56,29.49 16.56,28.75 18.95,26.36 18.95,19.36 v18.88,19.3 | v32.09,18.56 31.9,18.36
  Top 0.203: 32.2,18.71 32.2,21.01
  Bottom 0.2: v18.88,19.3 19.19,19.6 22.4,19.6 22.98,20.18 28.32,20.18 29.36,19.13 31.52,19.13 v32.09,18.56
MA21
  Top 0.2: U7.4 33.75,31.38 33.48,31.1
  Top 0.203: 33.48,31.1 33.48,24.79 31.75,23.06 31.75,20.26 SW3.S2 31.35,20.41
MULTI2  (via drill 0.35)
  Top 0.2: v33.03,18.48 33.03,18.51 33.1,18.57 SW3.P2 | v46.41,19.87 46.5,19.77 U1.39 | v12.99,19.3 13.06,19.36 13.06,20.8 12.17,21.69 v12.17,21.72 | U3.2 6.62,30.9 5.62,29.91 5.62,23.06 v5.32,22.76
  Bottom 0.2: v46.41,19.87 46.12,20.15 45.08,20.15 44.38,20.85 41.09,20.85 40.15,19.91 39.72,19.91 39.01,19.21 38.16,19.21 37.44,18.48 34.9,18.48 34.39,17.97 33.55,17.97 v33.04,18.48 v33.03,18.48 33.03,18.46 32.99,18.51 32.38,17.9 31.82,17.9 30.94,18.78 29.22,18.78 28.17,19.83 23.12,19.83 22.54,19.25 19.76,19.25 19.16,18.64 18.61,18.64 17.65,19.6 13.25,19.6 12.99,19.34 v12.99,19.3 | v12.17,21.72 11.87,21.42 10.02,21.42 8.98,22.45 5.62,22.45 v5.32,22.76
MUTLI1  (via drill 0.35)
  Top 0.2: SW3.P1 33.1,16.46 33.65,17.01 33.65,18.06 33.97,18.38 v33.97,18.63 | v46.37,20.81 46.52,20.81 47.1,20.23 47.1,19.46 47,19.36 U1.40
  Bottom 0.2: v33.97,18.63 34.06,18.63 34.26,18.83 37.29,18.83 38.02,19.56 38.87,19.56 39.57,20.26 40.01,20.26 40.95,21.21 44.52,21.21 45.23,20.5 46.07,20.5 v46.37,20.81
N$1
  Top 0.2: C8.1 23.35,54.71 23.35,53.89 24.35,52.89 R6.2 23.98,52.81 24.16,52.62 23.95,52.41 23.95,51.64 22.45,50.14 22.45,48.81 SW2.S2
N$2  (via drill 0.35)
  Top 0.2: U8.4 23.92,48.25 v23.27,47.6 | v22.17,50.78 22.17,51.98 SW2.S1
  Bottom 0.2: v23.27,47.6 23.43,47.75 23.43,49.18 22.17,50.44 v22.17,50.78
N$3  (via drill 0.35)
  Top 0.203: 30.75,53.27 U$7.+ 30.54,53.27 | 32,49.01 32.25,48.76 | v29.2,45.71 31,45.71 31.1,45.61
  Top 0.4: 30.89,53.28 U$7.+ | R1.2 29.49,38.24 32.53,38.24 32.6,38.31
  Bottom 0.203: 27.5,45.21 TP3.TP v29.2,45.71
  pour Top: 29.95,44.46 arc-90 39.72,54.24 arc-90 49.55,44.41 arc-90 39.77,34.64 arc-90
  pour Top: 30.35,54.26 30.35,51.14 32.15,49.34 33,49.34 34.8,51.14 34.8,52.06 32.6,54.26
N$4  (via drill 0.35)
  Top 0.203: U5.11 25.98,33.76 v26.5,34.28 26.67,34.12 29.12,34.12 30.05,35.04 30.85,35.04 U5.6 30.82,35.01 | U5.2 28.65,32.46 v28.6,32.51
  Bottom 0.203: v28.6,32.51 28.6,33.26 27.75,34.11 26.68,34.11 v26.5,34.28
N$6
  Top 0.2: R2.1 11.4,49.11 U2.20
N$7
  Top 0.2: R2.2 C2.1 9.15,51.91 9.75,52.51 14.25,52.51 X1.P$2
N$8
  Top 0.2: U2.19 12.2,48.46 12.75,49.01 14.45,49.01 15.1,49.66 Z1.1 16.15,50.51 17.4,51.76 17.4,54.96 17.1,55.26 X1.P$1
N$10
  Top 0.203: R9.2 25.25,24.76 25.25,24.21 26,23.46 26.15,23.46 R10.1 27.6,22.01 29.5,22.01 29.75,22.26 U4.8
N$14  (via drill 0.35)
  Top 0.203: U5.8 26.42,35.71 v26.5,35.63 | v26.5,33.34 26.27,33.11 U5.12
  Bottom 0.203: v26.5,33.34 26.49,33.34 25.84,33.99 25.84,34.97 v26.5,35.63
RA14  (via drill 0.35)
  Top 0.2: U2.15 16.95,45.01 18.4,43.56 18.4,35.26 17.35,34.21 17.35,32.26 v17.77,31.84 | v44.85,27.44 44.5,27.8 44.5,28.02 U1.6
  Top 0.203: 44.5,28.02 44.5,28.2
  Bottom 0.2: 17.84,31.84 v17.77,31.84 17.77,31.47 20.21,29.03 23.13,29.03 23.85,28.31 24.38,28.31 24.75,27.94 25.41,27.94 27.17,26.17 28.59,26.17 30.22,27.8 32.95,27.8 33.42,27.33 38.1,27.33 38.92,26.51 42.73,26.51 43.34,27.12 44.53,27.12 v44.85,27.44
RA15  (via drill 0.35)
  Top 0.2: v14.23,33.91 14.53,34.21 14.53,35.43 15.58,36.48 15.58,38.07 v15.28,38.38 | 6.62,40.18 U2.32 7.5,40.21 8.8,41.51 v9.95,41.51 | v45.16,29.47 45,29.62 45,30.01 45,30.26 U1.5
  Bottom 0.2: v15.28,38.38 14.28,38.38 11.14,41.51 v9.95,41.51 | v14.23,33.91 15.09,34.77 18.83,34.77 19.96,33.64 19.96,31.27 20.8,30.43 23.72,30.43 24.44,29.71 24.96,29.71 25.33,29.35 25.99,29.35 27.13,28.2 28.63,28.2 29.64,29.21 33.53,29.21 34.01,28.74 38.69,28.74 39.5,27.92 42.15,27.92 42.76,28.53 43.52,28.53 44.14,29.16 44.85,29.16 v45.16,29.46 v45.16,29.47
RA16  (via drill 0.35)
  Top 0.2: v13.88,34.8 14.18,35.1 14.18,35.58 15.23,36.63 15.23,37.5 14.62,38.1 14.62,39 v14.57,39.04 | U2.31 7.48,41.01 8.97,42.5 v9.95,42.5 | v45.66,30.44 45.5,30.59 U1.4
  Bottom 0.2: v13.88,34.8 14.61,34.8 14.94,35.12 18.98,35.12 20.32,33.78 20.32,31.42 20.94,30.79 23.86,30.79 24.58,30.07 25.11,30.07 25.48,29.7 26.14,29.7 27.28,28.56 28.48,28.56 29.49,29.57 33.68,29.57 34.15,29.09 38.83,29.09 39.65,28.27 42,28.27 42.61,28.88 43.37,28.88 43.99,29.51 44.27,29.51 44.88,30.12 45.35,30.12 v45.66,30.44 | v9.95,42.5 10.4,42.5 10.87,42.04 11.12,42.04 14.11,39.04 v14.57,39.04
RA17  (via drill 0.35)
  Top 0.2: U2.16 16.65,45.81 18.76,43.7 18.76,35.07 17.71,34.03 17.71,33.08 v18.01,32.78 | v45.78,27.46 45.81,27.49 45.81,29.65 46.33,30.17 46.33,30.71 45.99,31.05 U1.3
  Bottom 0.2: v18.01,32.78 18.01,32.53 18.5,32.04 18.5,31.24 20.36,29.38 23.28,29.38 24,28.66 24.52,28.66 24.89,28.29 25.55,28.29 27.31,26.53 28.45,26.53 30.08,28.16 33.09,28.16 33.57,27.68 38.25,27.68 39.07,26.86 42.59,26.86 43.2,27.47 43.95,27.47 44.58,28.1 45.15,28.1 v45.78,27.46
RA18  (via drill 0.35)
  Top 0.2: U2.17 15.61,47.42 19.11,43.92 19.11,34.45 v18.41,33.76 | v46.47,28.1 46.16,28.4 46.16,29.5 46.69,30.02 46.69,30.86 46.5,31.04 U1.2
  Bottom 0.2: v18.41,33.76 18.41,33.3 18.85,32.86 18.85,31.38 20.5,29.73 23.43,29.73 24.14,29.01 24.67,29.01 25.04,28.64 25.7,28.64 27.46,26.88 28.3,26.88 29.93,28.51 33.24,28.51 33.72,28.03 38.39,28.03 39.21,27.21 42.44,27.21 43.05,27.83 43.81,27.83 44.43,28.45 45.72,28.45 46.08,28.1 v46.47,28.1
RA19  (via drill 0.35)
  Top 0.2: v47.01,29.41 47.06,29.46 47.06,30.98 46.99,31.05 U1.1 | v5.57,38.65 5.27,38.95 5.27,41.41 5.67,41.81 U2.30
  Bottom 0.2: v5.57,38.65 5.57,37.95 5.22,37.6 5.22,35.92 6.55,34.59 8.52,34.59 9.5,33.61 12.5,33.61 13.22,34.33 13.22,35.11 13.58,35.48 15.54,35.48 15.54,35.47 19.06,35.47 19.5,35.91 20.04,35.91 20.43,35.53 20.43,34.67 21.02,34.07 21.02,31.71 21.23,31.49 24.16,31.49 24.87,30.77 25.4,30.77 25.77,30.4 26.43,30.4 27.57,29.26 28.19,29.26 29.2,30.27 33.97,30.27 34.45,29.8 36.39,29.8 36.99,30.4 37.54,30.4 38.5,29.44 38.98,29.44 39.8,28.62 41.86,28.62 42.47,29.24 43.22,29.24 43.85,29.86 44.12,29.86 45.35,31.09 45.93,31.09 46.31,30.71 46.31,30.11 v47.01,29.41
RA20  (via drill 0.35)
  Top 0.2: U2.18 13,48.31 13.3,48.61 14.92,48.61 19.47,44.06 19.47,35.43 19.64,35.25 v19.77,35.25 | SW3.O1 35,16.31 35,18.17 35.78,18.95 35.78,20.89 34.72,21.95 34.72,22.49 35.1,22.88 35.51,22.88 37.59,24.96 37.59,29.42 v37.27,29.75
  Bottom 0.2: v37.27,29.75 36.96,29.44 34.3,29.44 33.83,29.92 29.35,29.92 28.34,28.91 27.42,28.91 26.28,30.05 25.62,30.05 25.25,30.42 24.73,30.42 24.01,31.14 21.09,31.14 20.67,31.56 20.67,33.93 19.77,34.83 v19.77,35.25
RAM_/CS  (via drill 0.35)
  Top 0.2: v13.94,29.53 14.42,30.01 14.42,32.85 14.89,33.31 14.89,33.53 14.88,33.53 14.88,35.29 15.93,36.34 15.93,39.11 v15.63,39.41 | v9.53,43.34 9.45,43.41 U2.28 | v17.22,29.21 17.22,28.59 19.3,26.51 19.3,19.81 19.64,19.47 U3.22
  Top 0.203: U3.22 20.37,19.51
  Bottom 0.2: v15.63,39.41 15.63,39.44 15.37,39.7 13.95,39.7 11.26,42.39 11.01,42.39 10.07,43.34 v9.53,43.34 | v13.94,29.53 14.29,29.17 17.18,29.17 v17.22,29.21
SND  (via drill 0.35)
  Top 0.2: 48.25,9.71 P1.31 | v45.8,14.66 46,14.46 U1.38
  Top 0.203: R8.2 48.25,14.16 v48.25,12.81 48.25,9.71
  Bottom 0.2: v48.25,12.81 47.62,12.81 45.8,14.64 v45.8,14.66
VBAT  (via drill 0.35)
  Top 0.203: 30.88,23.11 U4.10 | R1.1 29.62,37.78 v29.93,37.48
  Top 0.4: 30.88,23.11 31.16,23.11 33.02,24.97 33.02,32.46 32.4,33.07 32.4,37.31 32.02,37.69 28.34,37.69 R1.1
  Bottom 0.203: v29.93,37.48 29.55,37.11 TP2.TP
VCC  (via drill 0.35)
  Top 0.203: R8.1 48.15,15.86 48.05,15.96 v48.05,18.66 | U4.2 30.25,29.01 C4.1 | R9.1 31.3,25.16 31.45,25.01 v31.45,24.49 | 36.73,25.51 36.57,25.51 36.33,25.26 | 42.05,34.49 41.67,34.1 | U1.31 42.5,19.91 | 41.6,30.36 41.5,30.46 U1.12 41.5,33.86 41.65,34.01 | 42.33,30.19 42.5,30.36 U1.10 42.5,33.91 42.4,34.01 | 25.55,50.33 U8.1 U8.5
  Top 0.4: 27.76,59.95 27.7,60.01 | C1.1 48.5,32.31 46.71,34.1 41.67,34.1 41.5,34.1 | 41.65,34.01 42.4,34.01 42.53,34.01 | U7.5 36.45,31.38 v36.46,31.39
  Top 0.5: 3,10.01 2,11.01 2,51.51 | 2,59.01 3,60.01 27.7,60.01 43,60.01 47,56.01 50,56.01 51,55.01 51,44.71 | 42.5,19.91 v42.35,20.06
  Top 1.5: P1.1 3,10.01
  Bottom 0.203: v48.05,18.66 47.5,19.21 45.45,19.21 44.35,20.31 42.6,20.31 v42.35,20.06 | TP5.TP 27.55,57.56 v29,57.56 | v31.45,24.49 32.2,25.24 32.2,25.16 36.23,25.16
  Bottom 0.4: v36.46,31.39 36.99,30.85 37.73,30.85 38.69,29.9 39.16,29.9 39.98,29.08 41.38,29.08 v41.66,29.35
  other vias: 32.12,25.16 34.95,24.26 35.88,24.26 31.23,25.39 45.55,34.66 44.9,35.31 49.15,39.81 49.15,38.81 36.58,24.89 42.48,24.59 42.48,23.49 42.48,22.39
  pour Top (rank 2): 3.7,1.01 3.7,7.41 4.5,7.41 4.5,42.11 3.5,43.11 3.5,50.51 5.2,50.51 5.2,55.31 17,55.31 17,56.16 20.6,56.16 20.6,54.61 24.65,54.61 24.65,55.01 31.5,55.01 31.5,46.91 53.5,34.52 53.5,62.51 -0.5,62.51 -0.5,1.01
  pour Top (rank 2): 41.3,35.91 41.3,20.71 42.35,19.66 42.35,12.66 43,12.66 43,17.06 43.35,17.41 43.35,24.71 43.9,25.26 43.85,25.26 42.7,26.41 42.7,33.26 47.65,33.26 47.65,36.51 41.9,36.51
  pour Top (rank 2): 30.25,27.39 30.25,26.31 29.2,25.26 26,25.26 26,24.01 30.75,24.01 30.75,23.26 31.5,23.26 32.75,24.51 32.75,27.39
  pour Bottom: 29.5,25.94 33,25.94 33.75,25.19 43,25.19 43,21.89 29.5,21.89
  pour Bottom: 44.23,35.48 45.55,34.16 49.5,38.11 49.5,40.16 48.9,40.16
  pour Top (rank 2): 25.3,56.51 25.3,55.41 24.6,54.71 23.3,54.71 23.3,52.11 24.2,52.11 25.55,50.76 25.55,51.14 26.82,51.14 30.1,54.41 30.1,56.61 30,56.51
  pour Top (rank 2): 33.9,23.94 36.73,23.94 37.8,25.01 37.8,25.81 34.9,25.81 33.9,24.81
VCC_SRAM  (via drill 0.35)
  Top 0.203: 22.68,30.63 C5.1 | U2.24 8.2,50.01 7.53,50.69 v7.53,51.46 7.53,51.77 v8,52.25 | 6,48.51 C6.1 | U5.10 23.15,34.41 23,34.26 23,32.76 | U5.13 23.75,32.46 | 23.75,32.46 23.05,32.46 23,32.51 23,32.76 | 23.75,32.46 23.75,31.76 23.8,31.81 U5.14 27.16,31.81 | C5.1 22.8,32.26 | 22.8,32.26 22.8,32.56 23,32.76 | U3.32 20.42,32.26 22.8,32.26 | U3.30 20.43,29.73 21.73,29.73 21.75,29.75 21.75,29.81 | 21.75,29.81 21.65,29.91 | 21.75,29.81 21.75,31.01 C5.1 | U5.1 27.16,31.81 | 27.16,31.81 27.16,33.49 27.43,33.76 U5.4 | R5.1 18.5,55.11 v18.15,55.46
  Bottom 0.203: v18.15,55.46 v18.15,54.46 | v7.53,51.46 7.53,51.77 v8,52.25
  other vias: 20.75,53.66 22.07,45.48 23.23,45.48 21.77,53.64 21.77,49.81
  pour Top (rank 2): 5.6,53.26 5.6,47.66 4.05,47.66 4.05,46.26 8.5,46.26 8.5,53.26
  pour Top: 18.5,34.26 18.5,29.01 20.98,29.01 20.98,29.61 22.98,29.61 22.98,31.44 31.77,31.44 31.8,31.46 31.8,34.16 26.2,34.16 26.2,34.41 23,34.41 23,36.76 23.62,36.76 23.62,47.66 22.32,47.66 22.32,52.86 22.07,52.86 22.08,54.06 20.32,54.06 20.32,55.81 16.7,55.81 16.7,53.19 20.18,53.19 20.18,46.14 21.4,46.14 21.4,36.44 19.48,36.44 19.2,36.16 19.2,34.96
  pour Top: 30.75,27.4 30.75,30.58 22.5,30.58 22.5,32.26 32.75,32.26 32.75,27.4
  pour Bottom: 7.2,52.61 7.2,51.16 9.2,51.16 9.2,51.51 13,51.51 15.65,54.16 18.55,54.16 18.55,55.84 12.32,55.84 11.5,55.01 8.9,55.01 8.9,54.31
  pour Bottom: 20.3,53.96 20.3,48.46 20.4,48.46 20.4,46.61 21.93,45.09 23.62,45.09 23.62,47.55 23.4,47.75 23.4,49.01 22.07,50.34 22.07,53.96

### Text on the board
tPlace: SW2B | ON | SW2A | SW3A | ON | SW3B
tNames: + | CR2025 | MBC3 | SW1 | CR2016 | - | EEPROM | SRAM | 29F032 / 29F033 | 62256 / 1008
tStop: GAME BOY MBC3 MULTICART | 1 | 32
bStop: v1.3 | www.mousebitelabs.com | SUPPORT ORIGINAL CREATORS!